# EasyEDA schematic sch.json
TITLE: USB HUB; REV: 1.0; Date: 2024-06-19; Sheet: 1/1; Drawn By: sahilchess09; Company: Dasari Corp
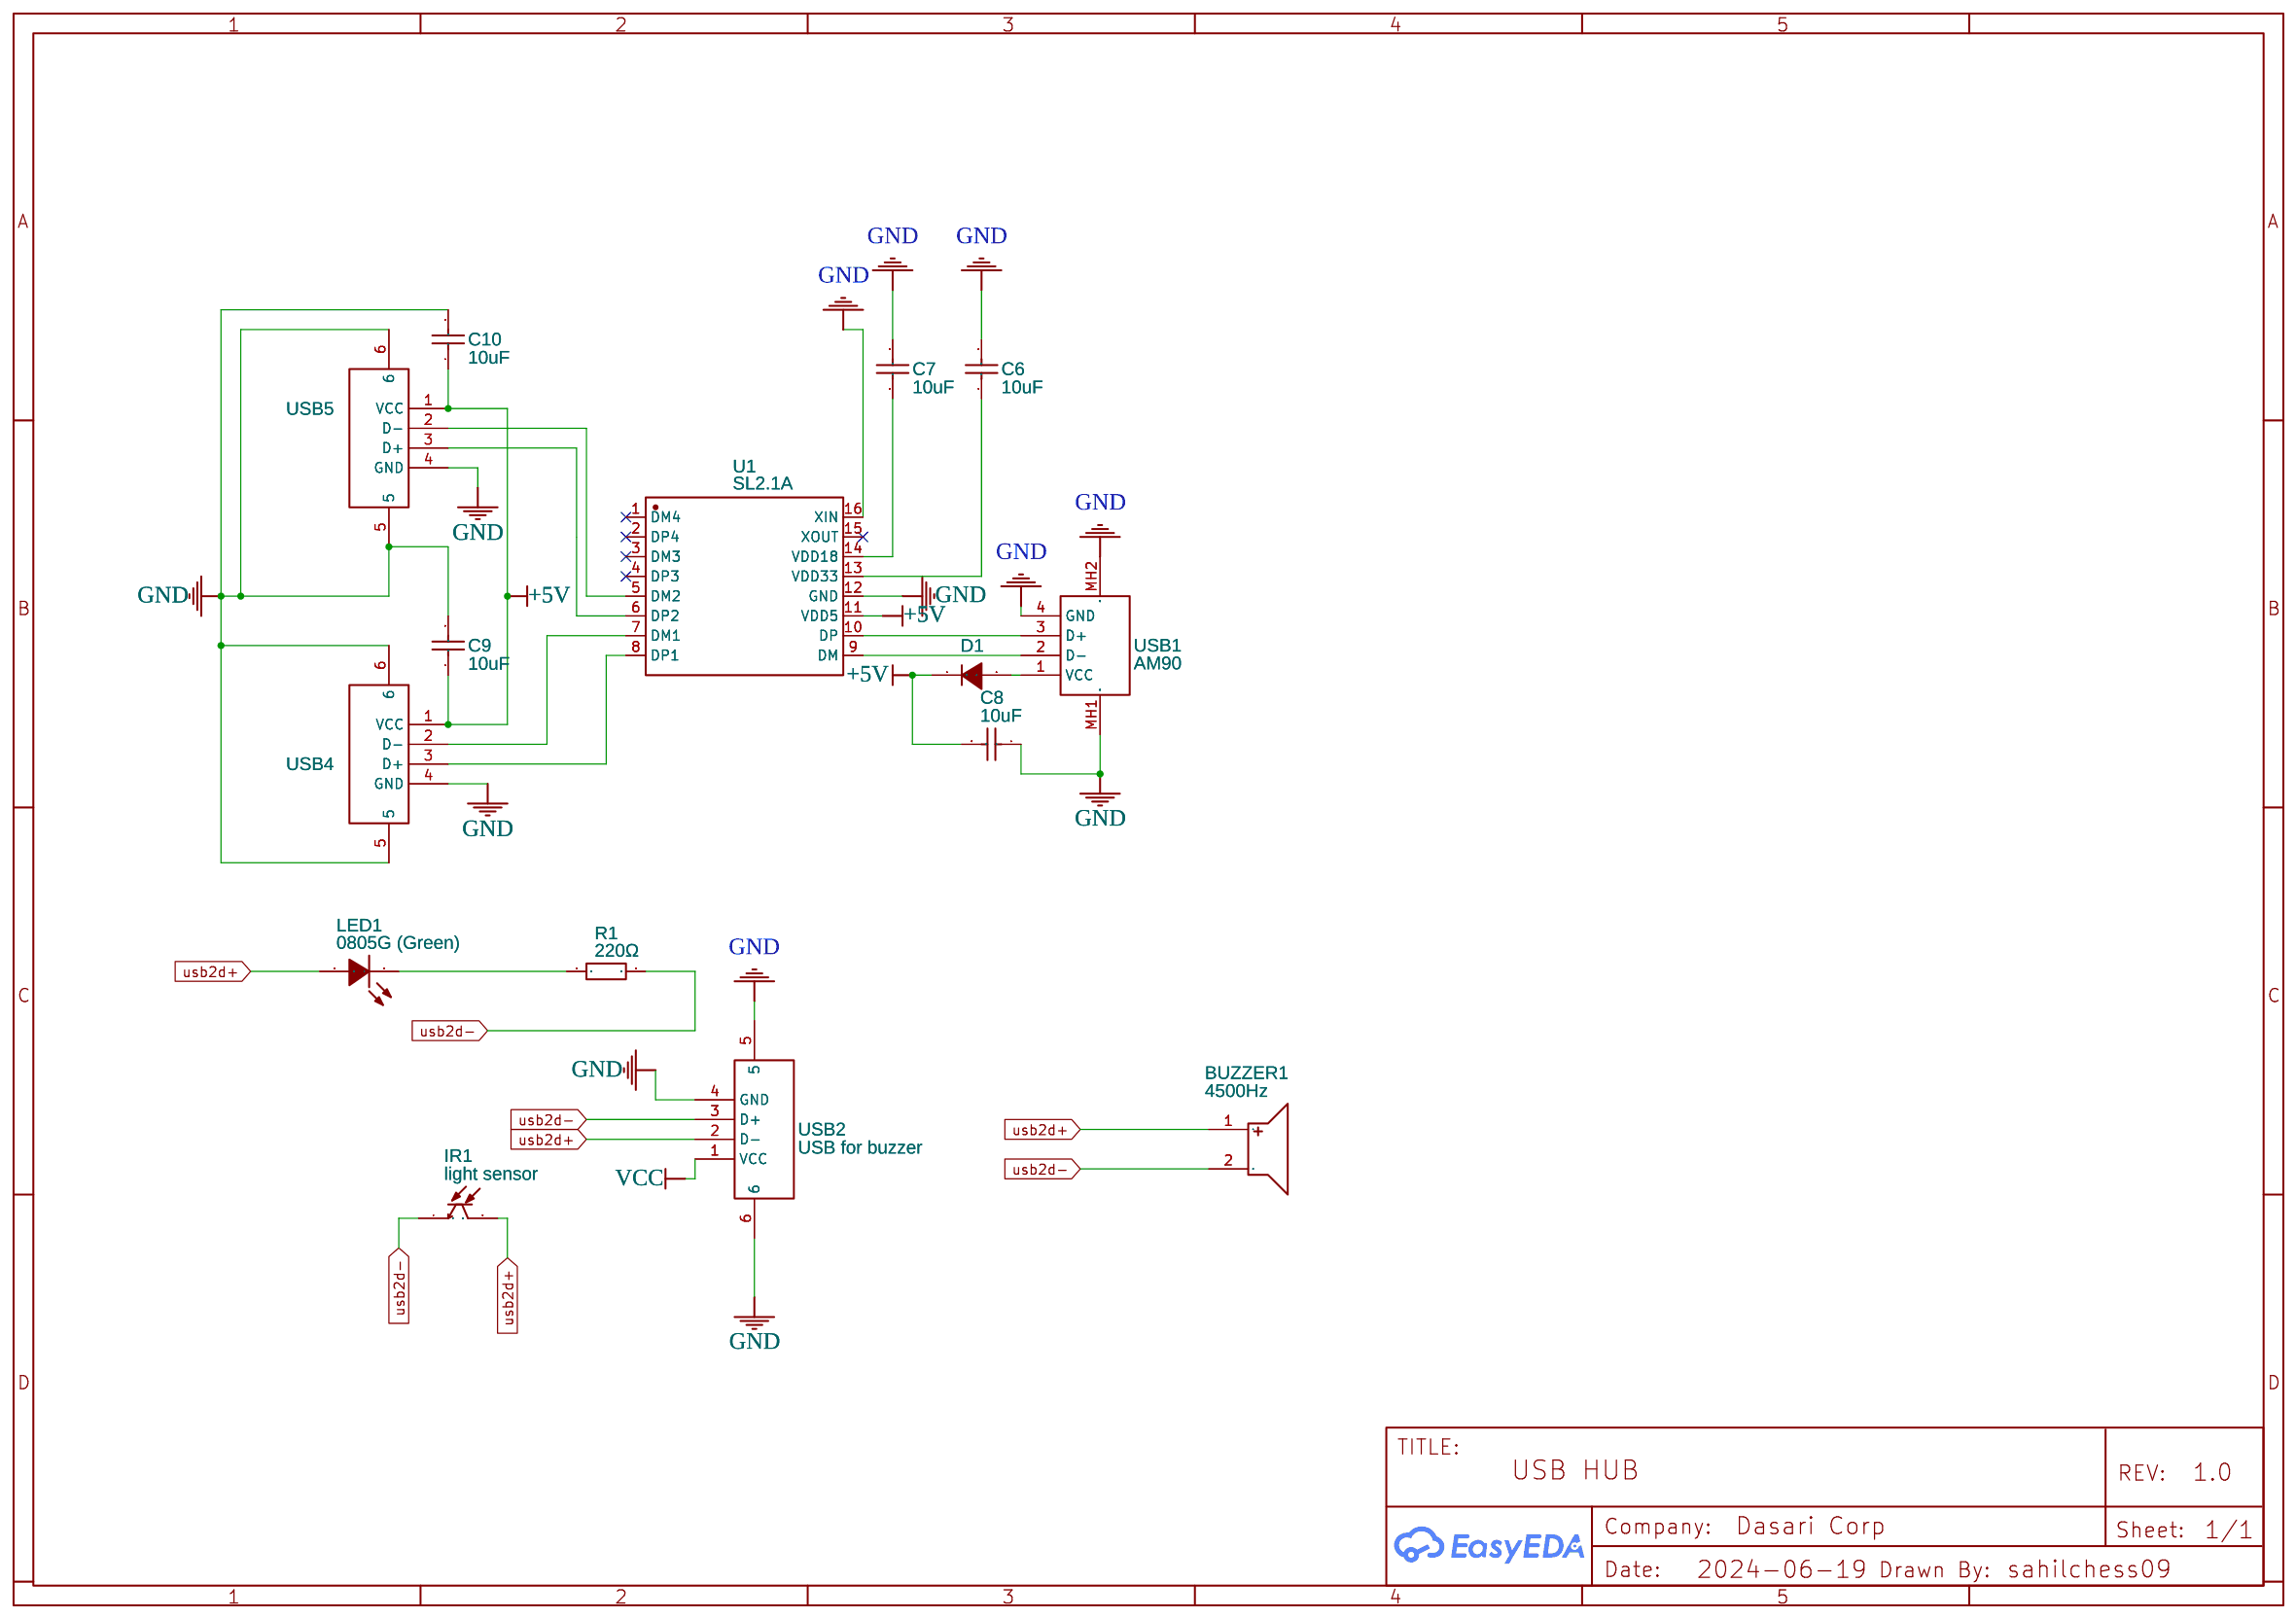
[diagram p0: schematic sheet]

## Parts
BUZZER1  4500Hz  [BUZ-TH_BD14.1-P7.62-D1.0-FD]
C6  10uF  [C0402]
C7  10uF  [C0402]
C8  10uF  [C0402]
C9  10uF  [C0402]
C10  10uF  [C0402]
D1  ‌  [SOD-323_L1.8-W1.3-LS2.5-RD]
IR1  light sensor  [LED-TH_L4.5-W1.5-P2.54-RD]
LED1  0805G (Green)  [LED0805-R-RD]
R1  220Ω  [R0805]
U1  SL2.1A  [SOP-16_L10.0-W3.9-P1.27-LS6.0-BL]
USB1  AM90  [USB-AM-TH_AM90]
USB2  USB for buzzer  [USB-A-TH_C46407]
USB4  USB-AF-90-14.4X13.6-H7.0-DIP  [USB-A-TH_C46407]
USB5  USB-AF-90-14.4X13.6-H7.0-DIP  [USB-A-TH_C46407]

## Library data of the parts
BUZZER1 = HND-1407B: Contributor: LCSC; Supplier: LCSC; Manufacturer: 华能; Supplier Part: C115184; JLCPCB Part Class: Extended Part
C6-C10 = CL05A106MQ5NUNC: Supplier: LCSC; Manufacturer: SAMSUNG(三星); Supplier Part: C15525; JLCPCB Part Class: Basic Part
D1 = NSR0320MW2T1G: Supplier: LCSC; Manufacturer: onsemi(安森美); Supplier Part: C48192; JLCPCB Part Class: Extended Part
IR1 = PT928-6C(6-1): Supplier: LCSC; Manufacturer: EVERLIGHT(亿光); Supplier Part: C72049; JLCPCB Part Class: Extended Part
LED1 = 0805G (Green): Supplier: LCSC; Manufacturer: KENTO; Manufacturer Part: KT-0805G; Supplier Part: C2297; JLCPCB Part Class: Basic Part
R1 = 0805W8F2200T5E: Supplier: LCSC; Manufacturer: UNI-ROYAL(厚声); Supplier Part: C17557; JLCPCB Part Class: Basic Part
U1 = SL2.1A: Contributor: LCSC; Supplier: LCSC; Supplier Part: C192893; Manufacturer: CoreChips(和芯润德); JLCPCB Part Class: Extended Part
USB1 = AM90: Contributor: LCSC; Supplier: LCSC; Supplier Part: C404965; Manufacturer: SHOU HAN(首韩); JLCPCB Part Class: Extended Part
USB2 USB4 USB5 = USB-AF-90-14.4X13.6-H7.0-DIP: Contributor: LCSC; Supplier: LCSC; Supplier Part: C46407; Manufacturer: 精拓金; Manufacturer Part: 903-131A1011D10100; JLCPCB Part Class: Extended Part

## Nets
+5V: C8.2 C9.1 C10.1 D1.1(C) U1.11(VDD5) USB4.1(VCC) USB5.1(VCC)
GND: C6.2 C7.2 C8.1 C9.2 C10.2 U1.12(GND) U1.16(XIN) USB1.4(GND) USB1.MH1 USB1.MH2 USB2.4(GND) USB2.5 USB2.6 USB4.4(GND) USB4.5 USB4.6 USB5.4(GND) USB5.5 USB5.6
VCC: USB2.1(VCC)
usb2d+: BUZZER1.1 IR1.2(C) LED1.1(A) USB2.2(D-)
usb2d-: BUZZER1.2 IR1.1(E) R1.2 USB2.3(D+)
Net-(C6-1): C6.1 U1.13(VDD33)
Net-(C7-1): C7.1 U1.14(VDD18)
Net-(D1-2): D1.2(A) USB1.1(VCC)
Net-(LED1-2): LED1.2(K) R1.1
Net-(U1-5): U1.5(DM2) USB5.2(D-)
Net-(U1-6): U1.6(DP2) USB5.3(D+)
Net-(U1-7): U1.7(DM1) USB4.2(D-)
Net-(U1-8): U1.8(DP1) USB4.3(D+)
Net-(U1-9): U1.9(DM) USB1.2(D-)
Net-(U1-10): U1.10(DP) USB1.3(D+)

Not connected (* = marked no-connect by the designer): U1 1(DM4)* 2(DP4)* 3(DM3)* 4(DP3)* 15(XOUT)*
